# Altium schematic sheet receiver 1.SchDoc
size A4; SheetNumber: 3; SheetTotal: 9; SPICEModelCacheALZHYQGP: <root> / <DocumentId>ALZHYQGP</DocumentId> / <CacheFrame Number="0"> / <Model Name="1206_156120rs82500" Kind="CKT"> / <Text>****** / .subckt 1206_156120RS82500  1  2 / D1 1 2 SMRW / .MODEL SMRW D / + IS=404.38E-18 / + N=2.1466 / + RS=.75545 / + IKF=193.03E-6 / + CJO=1.0000E-12 / + M=.3333 / + VJ=.75 / + BV=5 / + IBV=100.00E-6 / + TT=5.0000E-9 / .ends</Text> / </Model> / </CacheFrame> / </root>
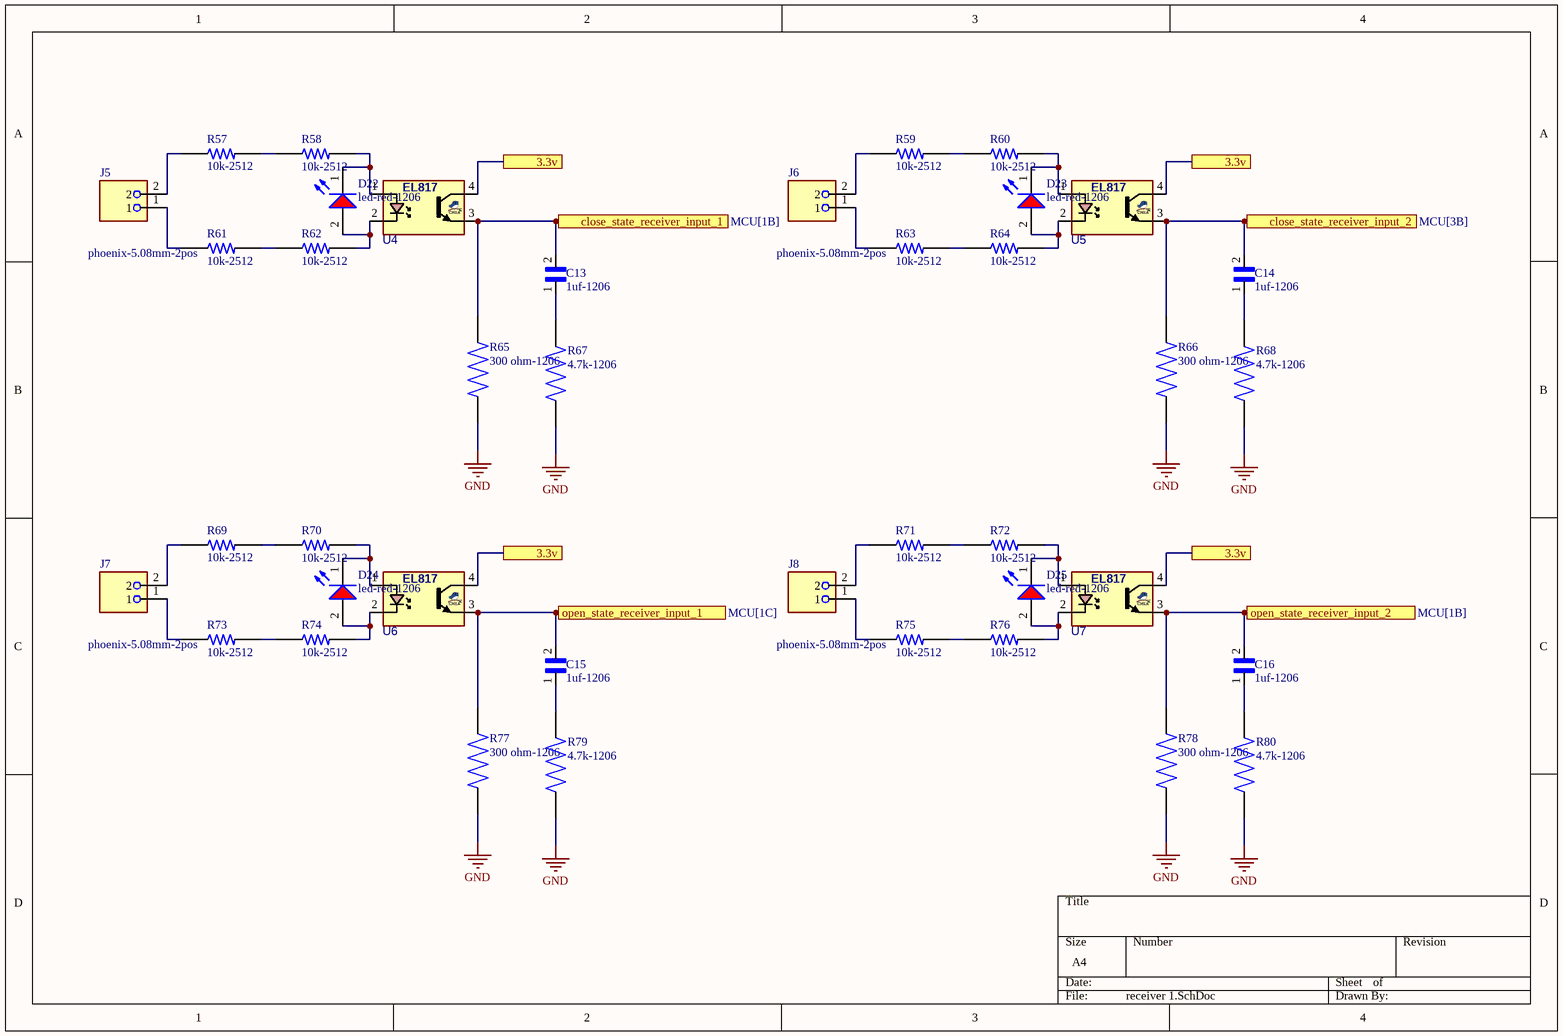
[diagram p0: receiver 1.SchDoc]

## Parts
C13  1uf-1206  [CAPC3216X180N]
C14  1uf-1206  [CAPC3216X180N]
C15  1uf-1206  [CAPC3216X180N]
C16  1uf-1206  [CAPC3216X180N]
D22  led-red-1206  [WL-SMRW_1206 dome_normal use]
D23  led-red-1206  [WL-SMRW_1206 dome_normal use]
D24  led-red-1206  [WL-SMRW_1206 dome_normal use]
D25  led-red-1206  [WL-SMRW_1206 dome_normal use]
J5  phoenix-5.08mm-2pos  [PHOENIX_1715721]
J6  phoenix-5.08mm-2pos  [PHOENIX_1715721]
J7  phoenix-5.08mm-2pos  [PHOENIX_1715721]
J8  phoenix-5.08mm-2pos  [PHOENIX_1715721]
R57  10k-2512  [RESC6331X70N]
R58  10k-2512  [RESC6331X70N]
R59  10k-2512  [RESC6331X70N]
R60  10k-2512  [RESC6331X70N]
R61  10k-2512  [RESC6331X70N]
R62  10k-2512  [RESC6331X70N]
R63  10k-2512  [RESC6331X70N]
R64  10k-2512  [RESC6331X70N]
R65  300 ohm-1206  [RESC3015X65N]
R66  300 ohm-1206  [RESC3015X65N]
R67  4.7k-1206  [RESC3015X65N]
R68  4.7k-1206  [RESC3015X65N]
R69  10k-2512  [RESC6331X70N]
R70  10k-2512  [RESC6331X70N]
R71  10k-2512  [RESC6331X70N]
R72  10k-2512  [RESC6331X70N]
R73  10k-2512  [RESC6331X70N]
R74  10k-2512  [RESC6331X70N]
R75  10k-2512  [RESC6331X70N]
R76  10k-2512  [RESC6331X70N]
R77  300 ohm-1206  [RESC3015X65N]
R78  300 ohm-1206  [RESC3015X65N]
R79  4.7k-1206  [RESC3015X65N]
R80  4.7k-1206  [RESC3015X65N]
U4  EL817  [DIP_4SMD]  (value not drawn)
U5  EL817  [DIP_4SMD]  (value not drawn)
U6  EL817  [DIP_4SMD]  (value not drawn)
U7  EL817  [DIP_4SMD]  (value not drawn)

## Ports
3.3v (see interface[1D], interface[3C], jack driver 1[2A], jack driver 1[3B], jack driver 2[2A], jack driver 2[3B], motor driver 1[2B], motor driver 1[3B], motor driver 2[2B], motor driver 2[3B], Power[2D], receiver 1[2A], receiver 1[2C], receiver 1[4A], receiver 2[2A], receiver 2[2C], receiver 2[4A], receiver 2[4C]), 3.3v (see interface[1D], interface[3C], jack driver 1[2A], jack driver 1[3B], jack driver 2[2A], jack driver 2[3B], motor driver 1[2B], motor driver 1[3B], motor driver 2[2B], motor driver 2[3B], Power[2D], receiver 1[2A], receiver 1[2C], receiver 1[4C], receiver 2[2A], receiver 2[2C], receiver 2[4A], receiver 2[4C]), 3.3v (see interface[1D], interface[3C], jack driver 1[2A], jack driver 1[3B], jack driver 2[2A], jack driver 2[3B], motor driver 1[2B], motor driver 1[3B], motor driver 2[2B], motor driver 2[3B], Power[2D], receiver 1[2A], receiver 1[4A], receiver 1[4C], receiver 2[2A], receiver 2[2C], receiver 2[4A], receiver 2[4C]), 3.3v (see interface[1D], interface[3C], jack driver 1[2A], jack driver 1[3B], jack driver 2[2A], jack driver 2[3B], motor driver 1[2B], motor driver 1[3B], motor driver 2[2B], motor driver 2[3B], Power[2D], receiver 1[2C], receiver 1[4A], receiver 1[4C], receiver 2[2A], receiver 2[2C], receiver 2[4A], receiver 2[4C]), close_state_receiver_input_1 (see MCU[1B]), close_state_receiver_input_2 (see MCU[3B]), open_state_receiver_input_1 (see MCU[1C]), open_state_receiver_input_2 (see MCU[1B])

## Nets
GND: R65.1 R66.1 R67.1 R68.1 R77.1 R78.1 R79.1 R80.1
3.3v: U4.4(C) U5.4(C) U6.4(C) U7.4(C) ; port 3.3v
close_state_receiver_input_1: C13.2 R65.2 U4.3(E) ; port close_state_receiver_input_1
close_state_receiver_input_2: C14.2 R66.2 U5.3(E) ; port close_state_receiver_input_2
open_state_receiver_input_1: C15.2 R77.2 U6.3(E) ; port open_state_receiver_input_1
open_state_receiver_input_2: C16.2 R78.2 U7.3(E) ; port open_state_receiver_input_2
NetC13_1: C13.1 R67.2
NetC14_1: C14.1 R68.2
NetC15_1: C15.1 R79.2
NetC16_1: C16.1 R80.2
NetD22_1: D22.1(K) R58.2 U4.1(A)
NetD22_2: D22.2(A) R62.2 U4.2(K)
NetD23_1: D23.1(K) R60.2 U5.1(A)
NetD23_2: D23.2(A) R64.2 U5.2(K)
NetD24_1: D24.1(K) R70.2 U6.1(A)
NetD24_2: D24.2(A) R74.2 U6.2(K)
NetD25_1: D25.1(K) R72.2 U7.1(A)
NetD25_2: D25.2(A) R76.2 U7.2(K)
NetJ5_1: J5.1 R61.1
NetJ5_2: J5.2 R57.1
NetJ6_1: J6.1 R63.1
NetJ6_2: J6.2 R59.1
NetJ7_1: J7.1 R73.1
NetJ7_2: J7.2 R69.1
NetJ8_1: J8.1 R75.1
NetJ8_2: J8.2 R71.1
NetR57_2: R57.2 R58.1
NetR59_2: R59.2 R60.1
NetR61_2: R61.2 R62.1
NetR63_2: R63.2 R64.1
NetR69_2: R69.2 R70.1
NetR71_2: R71.2 R72.1
NetR73_2: R73.2 R74.1
NetR75_2: R75.2 R76.1

## Library data of the parts
C13-C16 = CGA5L3X8R1H105M160AB: 1ÂµF Â±20% 50V Ceramic Capacitor X8R 1206 (3216 Metric); MF: TDK; Value: *; Purchase-URL: https://pricing.snapeda.com/search/part/CGA5L3X8R1H105M160AB/?ref=eda; Package: 3216 TDK; Availability: In Stock; SnapEDA_Link: https://www.snapeda.com/parts/CGA5L3X8R1H105M160AB/TDK/view-part/?ref=snap; MP: CGA5L3X8R1H105M160AB; Check_prices: https://www.snapeda.com/parts/CGA5L3X8R1H105M160AB/TDK/view-part/?ref=eda; Price: None
D22-D25 = 156120RS82500: WL-SMRW Mono-color Reverse mount Waterclear, SMT, size 1206 dome, Red, 2V, 20°; Manufacturer: Wurth Elektronik; Chip Technology: AlInGaP; Dominant Wavelength: 624nm; Luminous Intensity: 1100mcd; Peak Wavelength: 632nm; Manufacturer Part Number: 156120RS82500; Category: Signal LEDs; Match Code: WL-SMRW; ComponentLink1Description: Website Link; ComponentLink1URL: https://www.we-online.com/redexpert/article/156120RS82500?ad; ComponentLink2Description: Datasheet Link; ComponentLink2URL: https://www.we-online.com/redexpert/spec/156120RS82500?ad; Mount: Surface Mount; Operating Temperature Max: 85°C; Operating Temperature Min: -40°C; Packaging: Tape and Reel; Case/Size Code: 1206 dome; Length: 3.2mm; Width: 1.6mm; Height: 1.85mm; Emitting Color: Red; Forward Voltage: 2V; Viewing Angle: 20°
J5-J8 = 1715721: Package: None; Price: None; Value: *; MP: 1715721; Availability: Unavailable
R57-R64 R69-R76 = 5-2176246-2: 18 kOhms Â±5% 1.5W Chip Resistor 2512 (6432 Metric) Pulse Withstanding Thick Film; MF: TE Connectivity; SnapEDA_Link: https://www.snapeda.com/parts/5-2176246-2/TE+Connectivity+AMP+Connectors/view-part/?ref=snap; Package: None; Value: *; MP: 5-2176246-2; Check_prices: https://www.snapeda.com/parts/5-2176246-2/TE+Connectivity+AMP+Connectors/view-part/?ref=eda
R65-R68 R77-R80 = CPF1206B10KE1: Res Thin Film 1206 10K Ohm 0.1% 1/8W Â±25ppm/Â°C Molded SMD SMD Paper T/R; Power_Rating: .125 W; MF: TE Connectivity; Voltage_Rating: 150 V; Tolerance: .1%; SnapEDA_Link: https://www.snapeda.com/parts/CPF1206B10KE1/TE+Connectivity/view-part/?ref=snap; Package: 1206; Resistance: 10K; Value: *; MP: CPF1206B10KE1; EU_RoHS_Compliance: Compliant; Check_prices: https://www.snapeda.com/parts/CPF1206B10KE1/TE+Connectivity/view-part/?ref=eda
U4-U7 = OPTC_TR4P_EL817_SMD: OPTOCOUPLER, TRANSISTOR, 4PIN; PARAM: IF=5mA; PARAM2: VCE = 5V; PRICE: 300t@Paya; VALUE: EL817; PACKAGE: DIP-4SMD